# EAGLE design Timer (EAGLE 7.4.0)
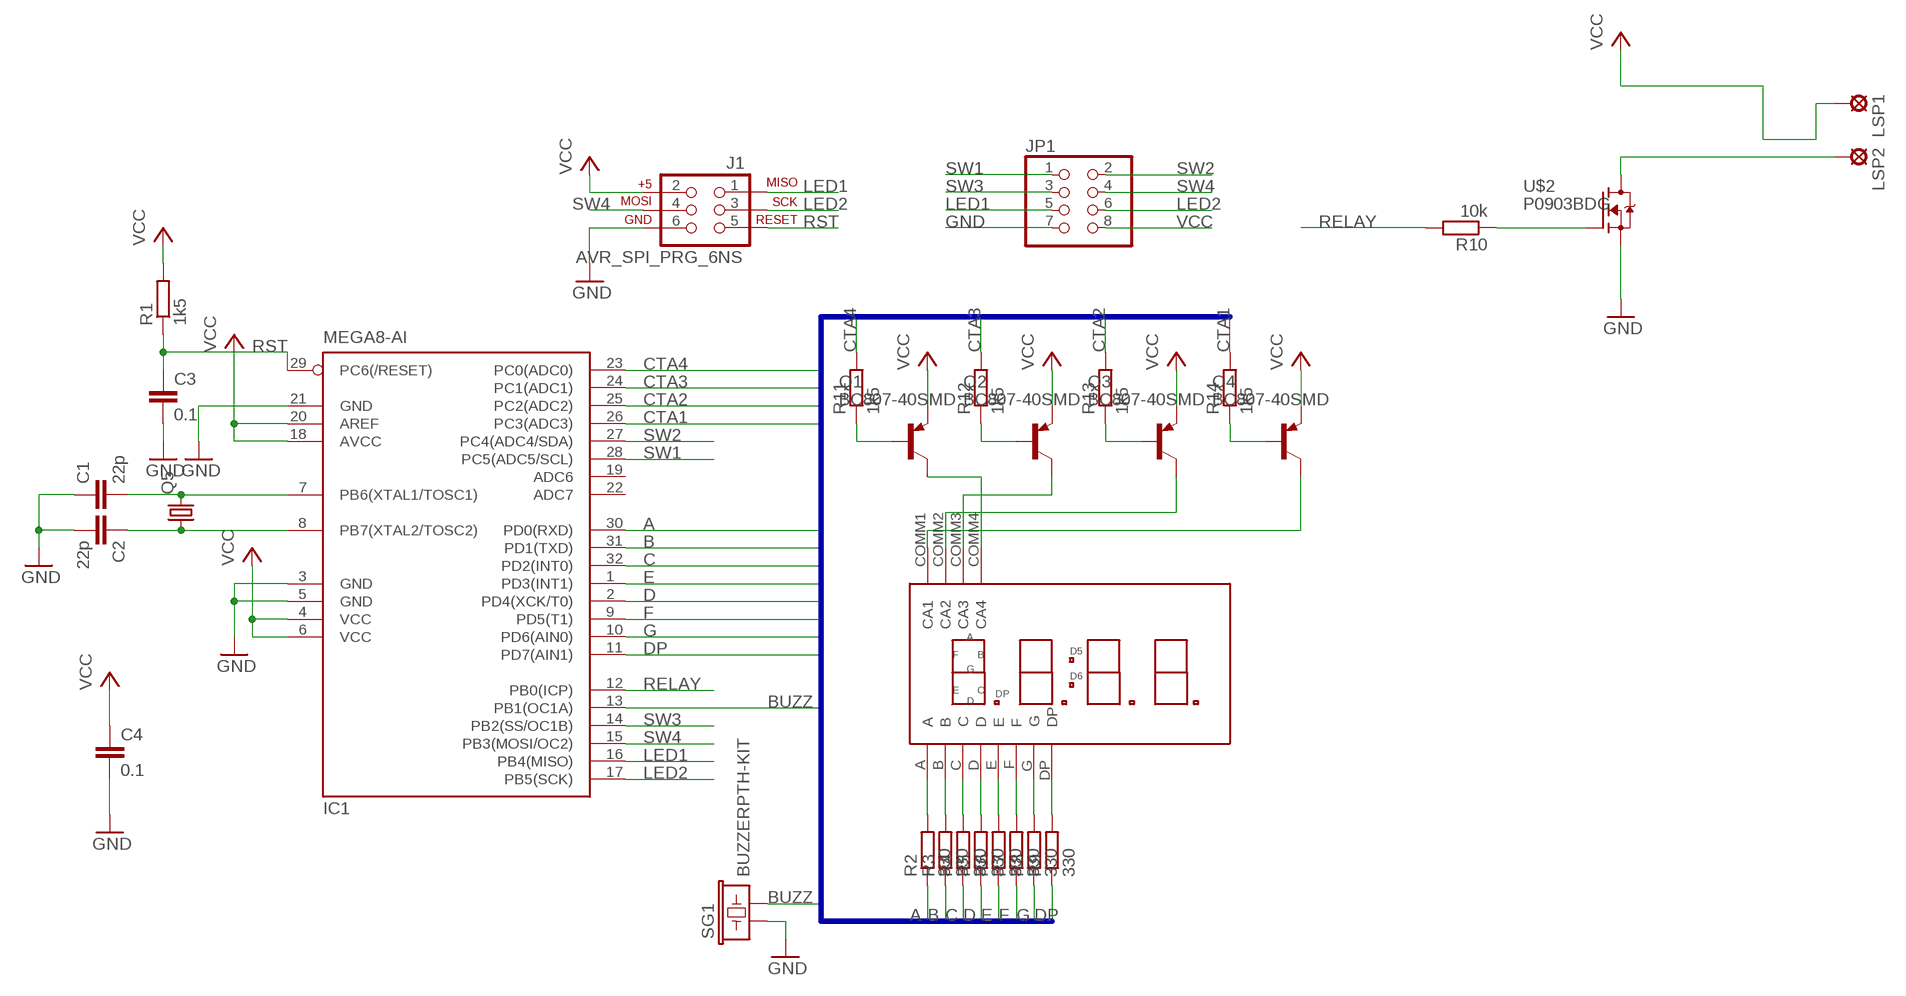
[diagram p0: schematic, sheet 1]

## Parts
C1  22p  C-EUC0805  [C0805]
C2  22p  C-EUC0805  [C0805]
C3  0.1  C-EUC0805  [C0805]
C4  0.1  C-EUC0805  [C0805]
IC1  MEGA8-AI  [TQFP32-08]
J1  AVR_SPI_PRG_6NS  [2X3-NS]
JP1  PINHD-2X4  [2X04]
LSP1  SE13  [SE13]
LSP2  SE13  [SE13]
Q1  BC807-40SMD  [SOT23-BEC]
Q2  BC807-40SMD  [SOT23-BEC]
Q3  BC807-40SMD  [SOT23-BEC]
Q4  BC807-40SMD  [SOT23-BEC]
Q5  CRYSTALHC49UP  [HC49UP]
R1  1k5  R-EU_R1206  [R1206]
R2  330  R-EU_R1206  [R1206]
R3  330  R-EU_R1206  [R1206]
R4  330  R-EU_R1206  [R1206]
R5  330  R-EU_R1206  [R1206]
R6  330  R-EU_R1206  [R1206]
R7  330  R-EU_R1206  [R1206]
R8  330  R-EU_R1206  [R1206]
R9  330  R-EU_R1206  [R1206]
R10  10k  R-EU_R1206  [R1206]
R11  1k5  R-EU_R1206  [R1206]
R12  1k5  R-EU_R1206  [R1206]
R13  1k5  R-EU_R1206  [R1206]
R14  1k5  R-EU_R1206  [R1206]
SG1  BUZZERPTH-KIT  [BUZZER-12MM-KIT]
U$1  FYG-5564BUG  [FYQ-5643XX]
U$2  P0903BDG  [TO252]

## Nets
A: IC1.30(PD0(RXD)) R2.1
B: IC1.31(PD1(TXD)) R3.1
BUZZ: IC1.13(PB1(OC1A)) SG1.-
C: IC1.32(PD2(INT0)) R4.1
CTA1: IC1.26(PC3(ADC3)) R14.2
CTA2: IC1.25(PC2(ADC2)) R13.2
CTA3: IC1.24(PC1(ADC1)) R12.2
CTA4: IC1.23(PC0(ADC0)) R11.2
D: IC1.2(PD4(XCK/T0)) R5.1
DP: IC1.11(PD7(AIN1)) R9.1
E: IC1.1(PD3(INT1)) R6.1
F: IC1.9(PD5(T1)) R7.1
G: IC1.10(PD6(AIN0)) R8.1
GND: C1.1 C2.2 C3.2 C4.2 IC1.3(GND) IC1.5(GND) IC1.21(GND) J1.6 JP1.7 SG1.+ U$2.3(S)
LED1: IC1.16(PB4(MISO)) J1.1 JP1.5
LED2: IC1.17(PB5(SCK)) J1.3 JP1.6
N$1: Q1.C U$1.COMM4(CA4)
N$2: Q2.C U$1.COMM3(CA3)
N$3: Q3.C U$1.COMM2(CA2)
N$4: Q4.C U$1.COMM1(CA1)
N$5: C1.2 IC1.7(PB6(XTAL1/TOSC1)) Q5.2
N$6: C2.1 IC1.8(PB7(XTAL2/TOSC2)) Q5.1
N$7: R10.1 U$2.1(G)
N$8: R2.2 U$1.A
N$9: R3.2 U$1.B
N$10: R4.2 U$1.C
N$11: R5.2 U$1.D
N$12: R6.2 U$1.E
N$13: R7.2 U$1.F
N$14: R8.2 U$1.G
N$15: R9.2 U$1.DP
N$16: LSP2.MP U$2.2(D)
N$17: Q3.B R13.1
N$18: Q1.B R11.1
N$19: Q2.B R12.1
N$20: Q4.B R14.1
RELAY: IC1.12(PB0(ICP)) R10.2
RST: C3.1 IC1.29(PC6(/RESET)) J1.5 R1.1
SW1: IC1.28(PC5(ADC5/SCL)) JP1.1
SW2: IC1.27(PC4(ADC4/SDA)) JP1.2
SW3: IC1.14(PB2(SS/OC1B)) JP1.3
SW4: IC1.15(PB3(MOSI/OC2)) J1.4 JP1.4
VCC: C4.1 IC1.4(VCC) IC1.6(VCC) IC1.18(AVCC) IC1.20(AREF) J1.2 JP1.8 LSP1.MP Q1.E Q2.E Q3.E Q4.E R1.2
Unconnected: IC1.19(ADC6) IC1.22(ADC7)

## Buses
B$1

## Library data of the parts
C1-C4 = rcl:C-EU: CAPACITOR, European symbol
IC1 = atmel:MEGA8: MICROCONTROLLER 8 Kbytes FLASH, 1 kbytes SRAM, 512 bytes EEPROM, USART, 6-channel 10 bit ADC, 2-channel 8 bit ADC Pin compatible with Atmega48, ATMega88, ATMega168 Source: avr.lbr; MPN: ATMEGA8-16AU; OC_FARNELL: 9171371; OC_NEWARK: 73M8863
J1 = SparkFun-Connectors:AVR_SPI_PRG_6: AVR ISP 6 Pin This is the reduced ISP connector for AVR programming. Common on Arduino. This footprint will take up less PCB space and can be used with a 10-pin to 6-pin adapter such as SKU: BOB-08508 **Special note about "TEST_POINT" package. The stop mask is on the top side, so if you want your programming test points to be on the bottom of your board, make sure to place this package on the bottom side of the board. This also ensure that the orientation to program from the bottom side will be correct.
JP1 = pinhead:PINHD-2X4: PIN HEADER
LSP1 LSP2 = solpad:SE13: SOLDER PAD E1542, drill 1,3mm, distributor Buerklin, 07F815
Q1-Q4 = transistor-pnp:BC807*: PNP Transistror
Q5 = crystal:CRYSTAL: CRYSTAL; OC_FARNELL: unknown; OC_NEWARK: unknown
R1-R14 = rcl:R-EU_: RESISTOR, European symbol
SG1 = SparkFun-Electromechanical:BUZZER: Buzzer 12mm Spark Fun Electronics SKU : Comp-Buzzer; PROD_ID: COMP-08253
U$1 = 7-segmentLED:FYG-5564BUG
U$2 = TransistorFAR:P0903BDG

## Board
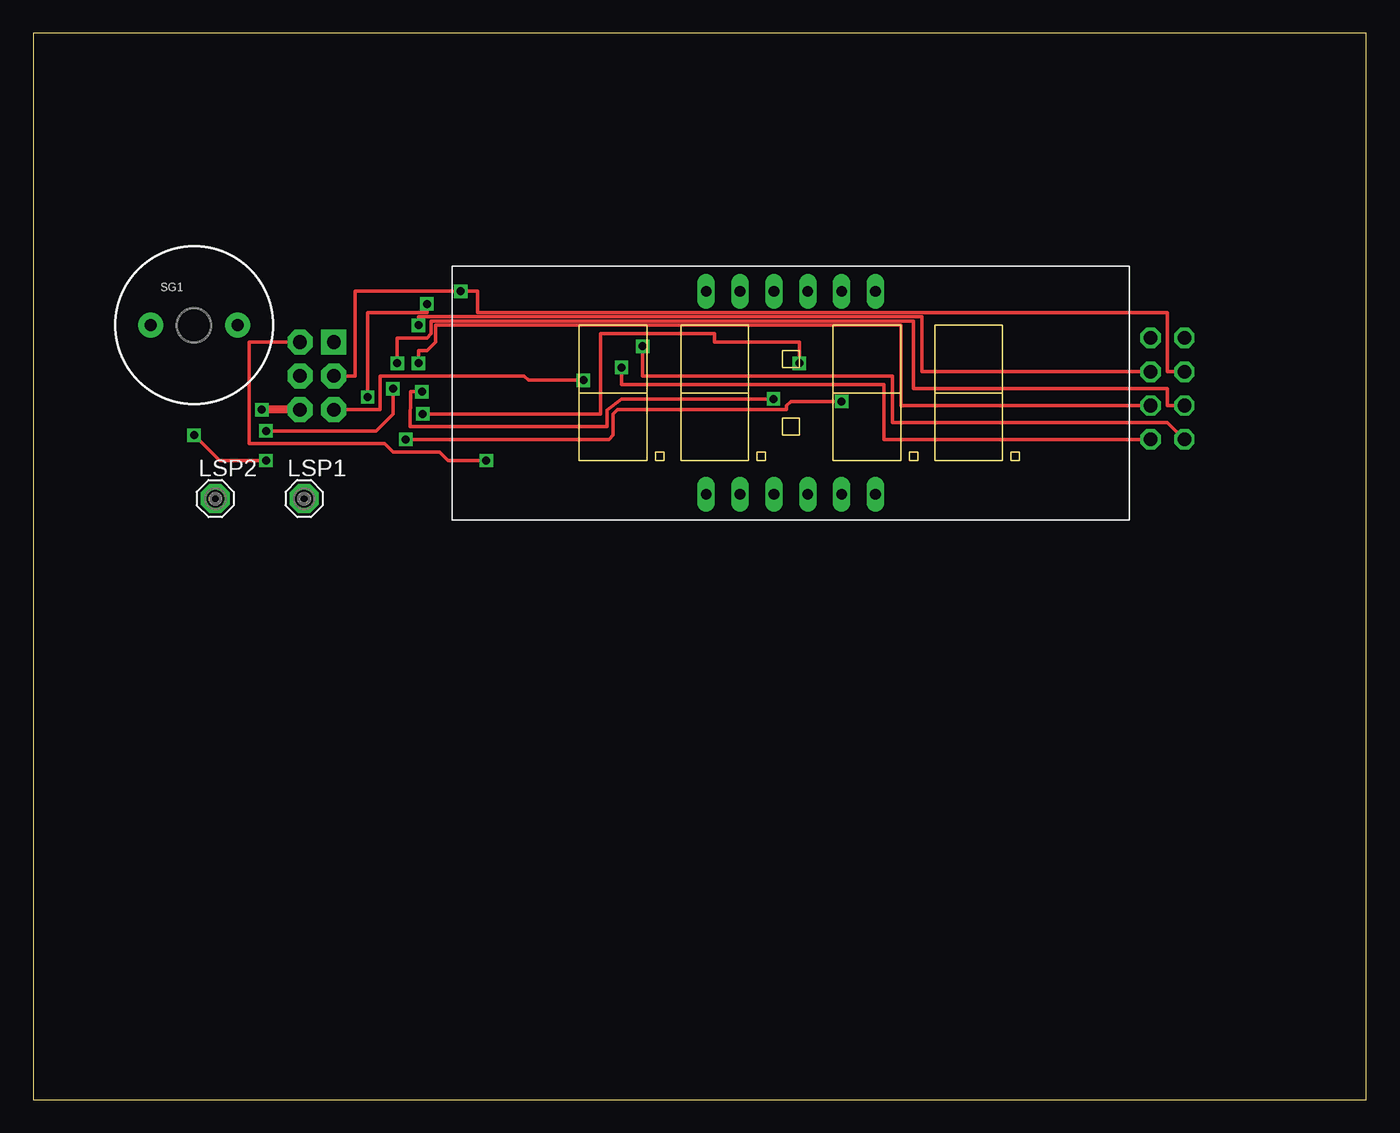
[diagram p1: board, top side]
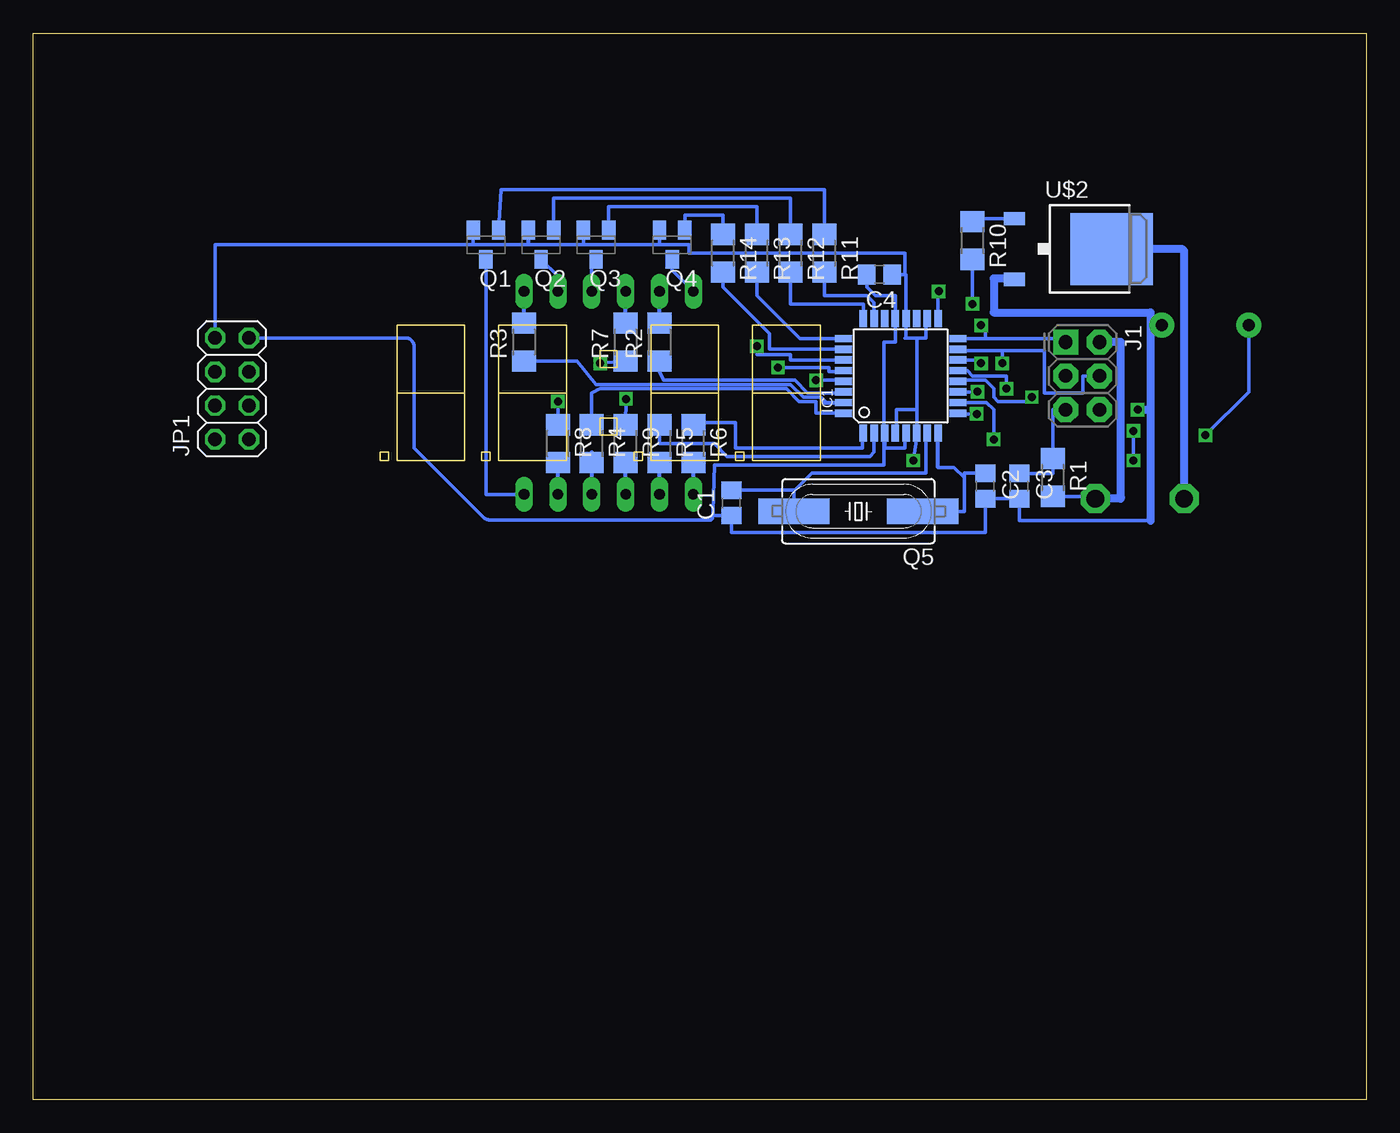
[diagram p2: board, bottom side, seen from below]

Size 100 x 80 mm. Coordinates in mm from the lower left corner, seen from the top.
Outline: 0,0 100,0 100,80 0,80 0,0
Copper layers (1*16): Top 0.035mm / dielectric 1.5mm / Bottom 0.035mm
Design rules "default": minimum track width 10mil, minimum drill 24mil, track to track 8mil, track to pad 8mil, pad to pad 8mil, via to via 8mil, smd to smd 8mil, copper to edge 40mil, drill to drill 8mil, minimum pad ring 10mil, minimum via ring 8mil, stop-mask expansion 4mil, vias tented up to drill 0mil, thermal gap 10mil

### Footprints (pad centres in the part's own frame; a part is rotated, then mirrored left to right if it is on the bottom)
C0805 = smd 1.3 x 1.5: 1 -0.95,0; 2 0.95,0
TQFP32-08 = smd 1.27 x 0.559: 1 -4.293,2.8; 2 -4.293,2; 3 -4.293,1.2; 4 -4.293,0.4; 5 -4.293,-0.4; 6 -4.293,-1.2; 7 -4.293,-2; 8 -4.293,-2.8; 17 4.293,-2.8; 18 4.293,-2; 19 4.293,-1.2; 20 4.293,-0.4; 21 4.293,0.4; 22 4.293,1.2; 23 4.293,2; 24 4.293,2.8 | smd 0.559 x 1.27: 9 -2.8,-4.293; 10 -2,-4.293; 11 -1.2,-4.293; 12 -0.4,-4.293; 13 0.4,-4.293; 14 1.2,-4.293; 15 2,-4.293; 16 2.8,-4.293; 25 2.8,4.293; 26 2,4.293; 27 1.2,4.293; 28 0.4,4.293; 29 -0.4,4.293; 30 -1.2,4.293; 31 -2,4.293; 32 -2.8,4.293
2X3-NS = drill 1.016 pad 1.88 square: 1 -2.54,-1.27 | drill 1.016 pad 1.88 octagon: 2 -2.54,1.27; 3 0,-1.27; 4 0,1.27; 5 2.54,-1.27; 6 2.54,1.27
2X04 = drill 1.016 octagon: 1 -3.81,-1.27; 2 -3.81,1.27; 3 -1.27,-1.27; 4 -1.27,1.27; 5 1.27,-1.27; 6 1.27,1.27; 7 3.81,-1.27; 8 3.81,1.27
SE13 = drill 1.321 pad 2.159 octagon: MP 0,0
SOT23-BEC = smd 1 x 1.4: B -0.95,-1.1; C 0,1.1; E 0.95,-1.1
HC49UP = smd 5.334 x 1.93: 1 -4.826,0; 2 4.826,0
R1206 = smd 1.6 x 1.803: 1 -1.422,0; 2 1.422,0
BUZZER-12MM-KIT = drill 0.9 pad 1.88: + 3.25,0; - -3.25,0
FYQ-5643XX = drill 0.8 long: A -3.81,7.62; B 6.35,7.62; C 1.27,-7.62; COMM1 -6.35,7.62; COMM2 1.27,7.62; COMM3 3.81,7.62; COMM4 6.35,-7.62; D -3.81,-7.62; DP -1.27,-7.62; E -6.35,-7.62; F -1.27,7.62; G 3.81,-7.62
TO252 = smd 1 x 1.6: 1 -2.28,-4.8; 3 2.28,-4.8 | smd 5.4 x 6.2: 2 0,2.5

### Placement (x,y rotation side)
C1  47.62,44.77 90 bottom
C2  28.57,46.04 270 bottom
C3  26.04,46.04 270 bottom
C4  36.51,61.91 180 bottom
IC1  34.92,54.29 90 bottom
J1  21.27,54.29 270 bottom
JP1  85.09,53.34 90 bottom
LSP1  20.32,45.09 0 top
LSP2  13.65,45.09 0 top
Q1  66.04,64.14 180 bottom
Q2  61.91,64.14 180 bottom
Q3  57.78,64.14 180 bottom
Q4  52.07,64.14 180 bottom
Q5  38.1,44.13 180 bottom
R1  23.5,46.67 270 bottom
R2  53.02,56.83 90 bottom
R3  63.18,56.83 90 bottom
R4  58.1,49.21 270 bottom
R5  53.02,49.21 270 bottom
R6  50.48,49.21 270 bottom
R7  55.56,56.83 90 bottom
R8  60.64,49.21 270 bottom
R9  55.56,49.21 270 bottom
R10  29.53,64.45 270 bottom
R11  40.64,63.5 270 bottom
R12  43.18,63.5 270 bottom
R13  45.72,63.5 270 bottom
R14  48.26,63.5 270 bottom
SG1  12.06,58.1 0 top
U$1  56.83,53.02 0 top
U$2  21.59,63.82 270 bottom

### Tracks (layer width: path | path; a pad name or v marks a point on that pad's centre or on a via)
A
  Bottom 0.254: R2.1 53.02,54.61 52.7,53.98 42.86,53.98 41.91,53.02 39.29,53.02 IC1.30
B
  Bottom 0.254: R3.1 59.22,55.41 57.78,53.66 43.18,53.66 42.23,52.7 40.96,52.7
  Bottom 0.305: 40.96,52.7 40.64,52.39 40.64,52.29 IC1.31
BUZZ  (via drill 0.6)
  Top 0.254: v26.99,53.34 26.99,51.44 25.72,50.16 v17.46,50.16 | v17.46,47.94 13.97,47.94 v12.06,49.85
  Bottom 0.254: IC1.13 29.93,54.69 29.53,54.29 26.99,54.29 v26.99,53.34 | v17.46,50.16 v17.46,47.94 | v12.06,49.85 8.81,53.1 SG1.-
C
  Bottom 0.254: IC1.32 41.27,51.49 41.27,52.39 42.55,52.39 43.5,53.34 57.47,53.34 58.1,53.02 R4.1
CTA1
  Bottom 0.254: IC1.26 44.77,56.29 44.77,57.47 48.26,60.96 R14.2
CTA2
  Bottom 0.254: IC1.25 42.49,57.09 45.72,60.33 R13.2
CTA3
  Bottom 0.254: IC1.24 37.73,59.69 43.18,59.69 R12.2
CTA4
  Bottom 0.254: IC1.23 36.92,59.78 37.47,60.33 40.64,60.33 R11.2
D
  Bottom 0.254: IC1.2 36.92,48.58 37.24,48.26 47.94,48.26 48.9,49.21 53.02,49.21 R5.1
DP  (via drill 0.6)
  Top 0.254: v29.16,53.12 28.29,53.1 28.26,50.48 43.04,50.48 43.04,51.72 44.14,52.55 v55.53,52.56
  Bottom 0.254: IC1.11 29.43,53.08 v29.16,53.12 | v55.53,52.56 R9.1
E
  Bottom 0.254: IC1.1 37.78,50 37.78,48.9 47.31,48.9 47.31,50.8 50.48,50.8 R6.1
F  (via drill 0.6)
  Top 0.254: v29.21,51.44 42.55,51.44 42.55,57.47 51.12,57.47 51.12,56.83 57.47,56.83 v57.47,55.24
  Bottom 0.254: R7.1 v57.47,55.24 | v29.21,51.44 30.63,51.44 IC1.9
G  (via drill 0.6)
  Top 0.254: v60.64,52.39 56.83,52.39 56.52,52.07 56.52,51.75 43.81,51.75 43.5,51.44 43.5,49.85 43.18,49.53 v27.94,49.53
  Bottom 0.254: R8.1 v60.64,52.39 | v27.94,49.53 27.94,51.75 28.48,52.29 IC1.10
GND  (via drill 0.6)
  Top 0.61: J1.6 v17.14,51.75
  Bottom 0.254: 36.2,50 IC1.3 36.12,48.9 34.61,48.9 34.61,50 IC1.5 | 36.2,50 36.2,56.83 35.33,56.83 IC1.21 35.33,60.33 36.83,60.33 37.47,60.96 C4.2 | 36.2,50 36.2,47.62 48.9,47.62 49.01,44.14 | 49.01,44.14 49.03,43.68 arc45 49.16,43.5 65.78,43.5 arc45 66.23,43.68 71.44,48.9 71.44,56.52 arc-90 72.07,57.15 JP1.7 | 49.01,44.14 49.01,43.82 C1.1 47.62,42.55 28.57,42.55 C2.2 C3.2 26.04,43.43 16.19,43.43 | SG1.+ 16.19,58.66 16.19,59.05
  Bottom 0.61: U$2.3 26.45,61.59 27.94,61.59 27.94,59.05 16.19,59.05 16.19,51.75 | 16.19,51.75 16.19,43.43 | v17.14,51.75 16.19,51.75
LED1  (via drill 0.6)
  Top 0.254: JP1.5 66.67,54.61 66.67,58.74 28.89,58.74 v28.89,58.1
  Bottom 0.254: J1.1 22.54,57.09 28.57,57.09 | 28.57,57.09 IC1.16 | v28.89,58.1 28.57,58.1 28.57,57.09
LED2  (via drill 0.6)
  Top 0.254: J1.3 24.13,54.29 24.13,60.64 v32.07,60.64 33.34,60.64 33.34,59.05 85.09,59.05 85.09,54.61 JP1.6
  Bottom 0.254: v32.07,60.64 32.12,60.33 IC1.17
N$1
  Bottom 0.254: Q1.C 66.04,45.4 U$1.COMM4
N$2
  Bottom 0.254: U$1.COMM3 60.64,61.77 Q2.C
N$3
  Bottom 0.254: U$1.COMM2 58.1,62.72 Q3.C
N$4
  Bottom 0.254: Q4.C 52.07,62.23 U$1.COMM1
N$5
  Bottom 0.254: IC1.7 33.02,50 33.02,46.99 41.59,46.99 42.86,45.72 | C1.2 42.86,45.72 | 42.86,45.72 42.93,45.72 Q5.2
N$6
  Bottom 0.254: Q5.1 30.16,44.13 30.16,46.67 | 30.16,46.67 30.16,46.99 C2.1 | 32.12,47.43 30.92,47.43 30.16,46.67
  Bottom 0.305: 32.12,47.43 IC1.8
N$7
  Bottom 0.254: R10.1 29.53,66.1 U$2.1
N$8
  Bottom 0.305: R2.2 U$1.A
N$9
  Bottom 0.305: R3.2 U$1.B
N$10
  Bottom 0.305: 58.1,48.58 R4.2 U$1.C
N$11
  Bottom 0.305: U$1.D R5.2
N$12
  Bottom 0.305: U$1.E R6.2
N$13
  Bottom 0.305: R7.2 U$1.F
N$14
  Bottom 0.305: U$1.G R8.2
N$15
  Bottom 0.305: U$1.DP R9.2
N$16
  Bottom 0.61: LSP2.MP 13.65,63.56 arc-90 13.91,63.82 U$2.2
N$17
  Bottom 0.254: R13.1 45.72,66.99 56.83,66.99 Q3.B
N$18
  Bottom 0.254: Q1.B 64.92,68.26 40.64,68.26 R11.1
N$19
  Bottom 0.254: R12.1 43.18,67.63 60.96,67.63 Q2.B
N$20
  Bottom 0.254: R14.1 48.26,66.36 51.12,66.36 Q4.B
RELAY  (via drill 0.6)
  Top 0.254: v29.53,59.69 29.53,59.05 25.08,59.05 v25.08,52.7
  Bottom 0.254: R10.2 v29.53,59.69 | IC1.12 30.55,53.98 28.57,53.98 27.94,53.34 27.94,52.7 27.62,52.39 25.4,52.39 v25.08,52.7
RST  (via drill 0.6)
  Top 0.254: J1.5 26.04,51.75 26.04,54.29 36.83,54.29 37.15,53.98 v41.27,53.98
  Bottom 0.254: v41.27,53.98 39.22,53.98 IC1.29 | J1.5 23.5,51.75 R1.1 23.5,46.99 C3.1
SW1  (via drill 0.6)
  Top 0.254: JP1.1 63.82,49.53 63.82,53.66 44.13,53.66 v44.13,54.93
  Bottom 0.254: v44.13,54.93 40.32,54.93 40.32,54.61 39.22,54.61 IC1.28
SW2  (via drill 0.6)
  Top 0.254: JP1.2 85.09,50.8 64.45,50.8 64.45,54.29 45.72,54.29 v45.72,56.52
  Bottom 0.254: IC1.27 43.18,55.49 43.18,55.88 45.72,55.88 v45.72,56.52
SW3  (via drill 0.6)
  Top 0.254: JP1.3 65.09,52.07 65.09,58.1 30.16,58.1 30.16,56.83 29.53,56.2 28.89,56.2 v28.89,55.24
  Bottom 0.254: v28.89,55.24 29.14,55.49 IC1.14
SW4  (via drill 0.6)
  Top 0.254: JP1.4 85.09,52.07 85.09,53.34 66.04,53.34 66.04,58.42 29.84,58.42 29.84,57.47 29.53,57.15 27.3,57.15 v27.3,55.24
  Bottom 0.254: J1.4 21.27,54.29 21.27,53.02 24.13,53.02 24.13,56.2 27.3,56.2 | 27.3,56.2 30.63,56.2 IC1.15 | v27.3,55.24 27.3,56.2
VCC  (via drill 0.6)
  Top 0.254: J1.2 16.19,56.83 16.19,49.21 26.35,49.21 26.99,48.58 30.48,48.58 31.11,47.94 v33.97,47.94
  Bottom 0.254: IC1.18 33.02,58.59 33.02,57.15 33.73,57.15 | 33.73,57.15 34.52,57.15 | 34.61,57.15 34.52,57.15 | 34.52,57.15 IC1.20 | 33.73,57.15 IC1.6 | IC1.6 33.73,51.75 35.24,51.75 35.24,50 IC1.4 | IC1.6 33.66,50 v33.97,47.94 | 58.74,65.41 58.73,65.41 Q3.E | Q3.E 58.73,65.41 | 62.87,65.41 62.86,65.41 Q2.E | 53.02,64.14 50.8,64.14 50.8,63.5 34.61,63.5 34.61,61.91 C4.1 34.52,61.91 IC1.20 | 53.02,64.14 58.74,64.14 | 58.74,64.14 Q3.E | Q1.E 66.99,64.14 | 66.99,64.14 62.87,64.14 Q2.E | Q2.E 62.86,64.14 58.74,64.14 | IC1.20 34.61,58.67 | 66.99,64.14 86.36,64.14 JP1.8 | LSP1.MP 20.32,45.25 R1.2 | Q4.E 53.02,64.14
  Bottom 0.61: 18.41,45.25 18.41,56.83 J1.2 | 18.48,45.25 18.41,45.25 | 18.41,45.25 18.41,45.09 LSP1.MP